# Altium schematic sheet 系统接线图.SchDoc
size A3
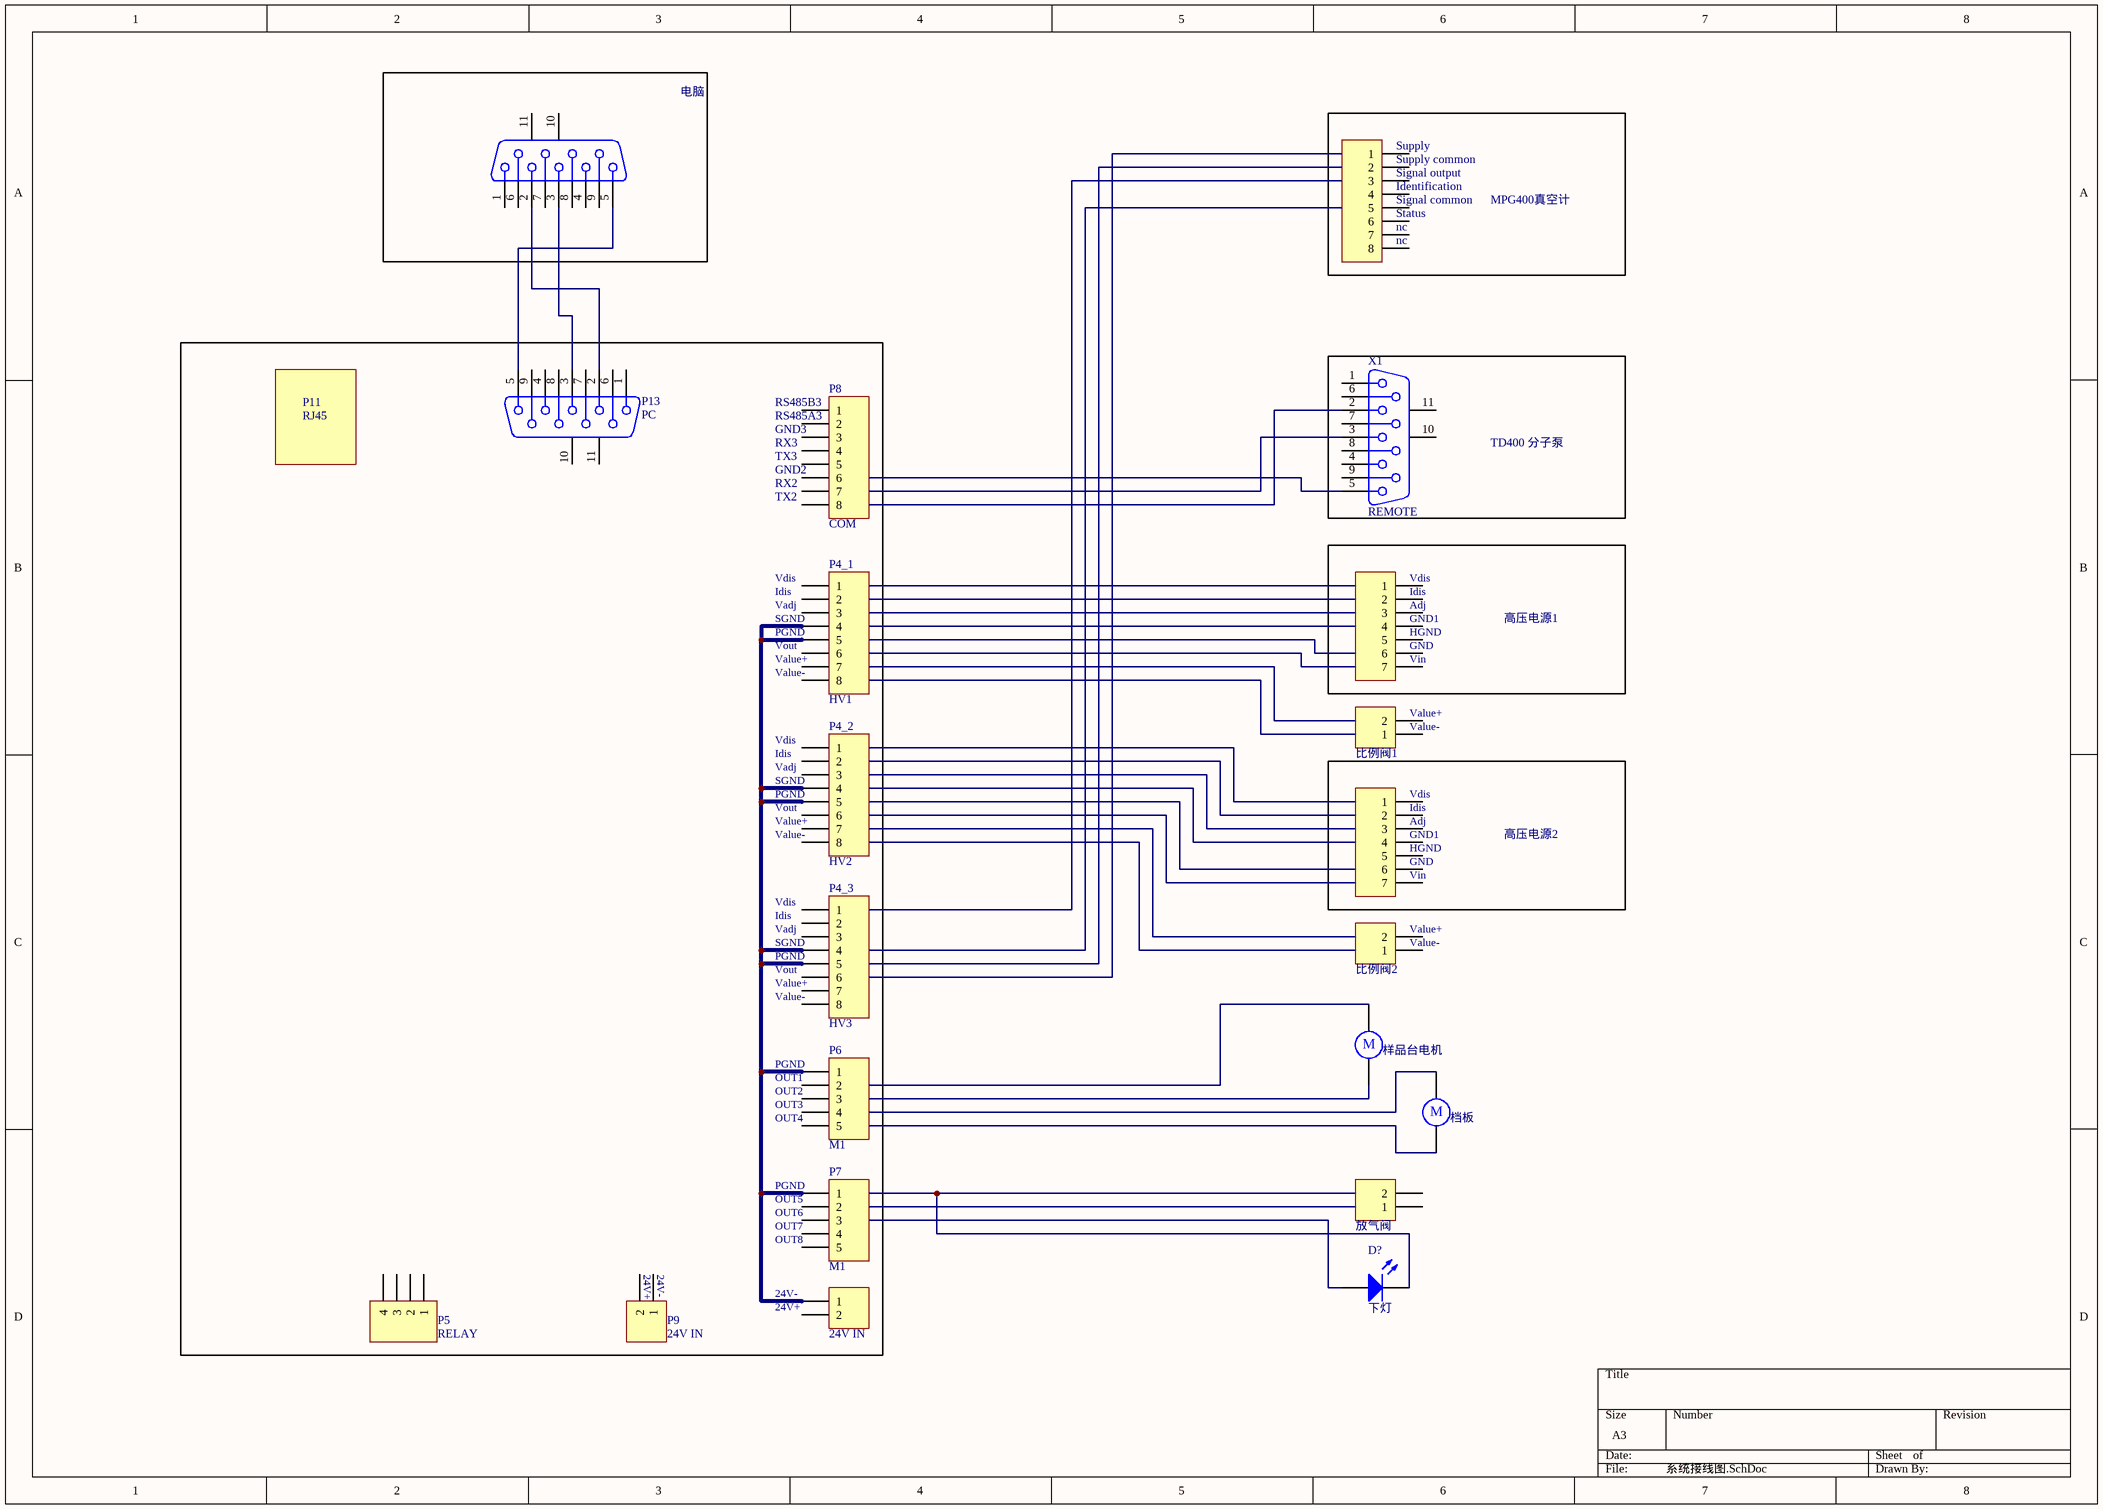
[diagram p0: 系统接线图.SchDoc]

## Parts
(Parts that share a designator on the sheet are numbered #1, #2 ... from top to bottom, then left to right.)
B?#1  样品台电机  [RB5-10.5]
B?#2  档板  [RB5-10.5]
D?  下灯  [LED-0]
P1  24V IN  [MHDR1X2]
P4_1  HV1  [MHDR1X8]
P4_2  HV2  [MHDR1X8]
P4_3  HV3  [MHDR1X8]
P5  RELAY  [MHDR1X4]
P6  M1  [MHDR1X5]
P7  M1  [MHDR1X5]
P8  COM  [MHDR1X8]
P9  24V IN  [MHDR1X2]
P13  PC  [DSUB1.385-2H9]
P?#1  PC  [DSUB1.385-2H9]  (value not drawn)
P?#2  MPG400真空计  [MHDR1X8]
P?#3  高压电源1  [MHDR1X7]
P?#4  比例阀1  [MHDR1X2]
P?#5  高压电源2  [MHDR1X7]
P?#6  比例阀2  [MHDR1X2]
P?#7  放气阀  [MHDR1X2]
X1  REMOTE  [DSUB1.385-2H9]

## Blocks framed on the sheet
电脑: P?#1
TD400 分子泵: X1

## Nets
NetP1_1: P1.1 P4_1.4 P4_1.5 P4_2.4 P4_2.5 P4_3.4 P4_3.5 P6.1 P7.1
NetP13_2: P13.2 P?#1.2
NetP13_3: P13.3 P?#1.3
NetP13_5: P13.5 P?#1.5

Not connected (* = marked no-connect by the designer): B?#1 1 2; B?#2 1 2; D? 1(A) 2(K); P1 2; P4_1 1 2 3 6 7 8; P4_2 1 2 3 6 7 8; P4_3 1 2 3 6 7 8; P5 1 2 3 4; P6 2 3 4 5; P7 2 3 4 5; P8 1 2 3 4 5 6 7 8; P9 1 2; P13 1 4 6 7 8 9 10(MH1) 11(MH2); P?#1 1 4 6 7 8 9 10(MH1) 11(MH2); P?#2 1 2 3 4 5 6 7 8; P?#3 1 2 3 4 5 6 7; P?#4 1 2; P?#5 1 2 3 4 5 6 7; P?#6 1 2; P?#7 1 2; X1 1 2 3 4 5 6 7 8 9 10(MH1) 11(MH2)

## Notes on the sheet
- (near P?#2) Supply
- (near P?#2) Supply common
- (near P?#2) Signal output
- (near P?#2) Identification
- (near P?#2) Signal common
- (near P?#2) Status
- (near P?#2) nc
- RJ45
- P11
- (near P8) RX3
- (near P8) GND3
- (near P8) RS485A3
- (near P8) RS485B3
- (near P8) TX2
- (near P8) RX2
- (near P8) GND2
- (near P8) TX3
- (near P4_1) Vdis
- (near P?#3) Vdis
- (near P4_1) Idis
- (near P4_1) Vadj
- (near P4_1) SGND
- (near P4_1) PGND
- (near P4_1) Vout
- (near P?#3) Idis
- (near P?#3) Adj
- (near P?#3) GND1
- (near P?#3) GND
- (near P?#3) HGND
- (near P4_1) Value+
- (near P4_1) Value-
- (near P?#3) Vin
- (near P?#4) Value+
- (near P4_2) Vdis
- (near P4_2) Idis
- (near P4_2) Vadj
- (near P4_2) SGND
- (near P?#4) Value-
- (near P4_2) PGND
- (near P4_2) Vout
- (near P4_2) Value+
- (near P4_2) Value-
- (near P?#5) Vdis
- (near P?#5) Idis
- (near P?#5) Adj
- (near P?#5) GND1
- (near P?#5) HGND
- (near P4_3) Vdis
- (near P4_3) Idis
- (near P?#5) GND
- (near P?#5) Vin
- (near P4_3) Vadj
- (near P4_3) SGND
- (near P4_3) PGND
- (near P4_3) Vout
- (near P4_3) Value+
- (near P?#6) Value+
- (near P?#6) Value-
- (near P4_3) Value-
- (near P6) PGND
- (near P6) OUT1
- (near P6) OUT2
- (near P6) OUT3
- (near P6) OUT4
- (near P7) PGND
- (near P7) OUT5
- (near P7) OUT6
- (near P7) OUT7
- (near P7) OUT8
- (near P9) 24V+
- (near P9) 24V-
- (near P1) 24V-
- (near P1) 24V+
- (in symbol Motor) M

## Library data of the parts
B?#1 B?#2 = Motor: Motor, General Kind; Published: 24-Mar-1999; LatestRevisionDate: 17-Jul-2002; LatestRevisionNote: Re-released for DXP Platform.; PackageReference: RB5-10.5; Publisher: Altium Limited; PackageDescription: Capacitor (Radial); 2 Leads
D? = LED0: Typical INFRARED GaAs LED; Published: 8-Jun-2000; LatestRevisionDate: 08-Jul-2005; LatestRevisionNote: Mech Layer 1 removed.; PackageReference: LED-0; Publisher: Altium Limited; PackageDescription: LED; 2 Leads
P1 P9 P?#4 P?#6 P?#7 = MHDR1X2: Header, 2-Pin; LatestRevisionDate: 17-Jul-2002; LatestRevisionNote: Re-released for DXP Platform.; Publisher: Altium Limited
P4_1-P4_3 P8 P?#2 = MHDR1X8: Header, 8-Pin; LatestRevisionDate: 17-Jul-2002; LatestRevisionNote: Re-released for DXP Platform.; Publisher: Altium Limited
P5 = MHDR1X4: Header, 4-Pin; LatestRevisionDate: 17-Jul-2002; LatestRevisionNote: Re-released for DXP Platform.; Publisher: Altium Limited
P6 P7 = MHDR1X5: Header, 5-Pin; LatestRevisionDate: 17-Jul-2002; LatestRevisionNote: Re-released for DXP Platform.; Publisher: Altium Limited
P13 P?#1 X1 = D Connector 9: Receptacle Assembly, 9 Position, Right Angle; PackageDocument: O; Positions: 9; Published: 15-Jun-2001; LatestRevisionDate: 17-Jul-2002; LatestRevisionNote: Re-released for DXP Platform.; DatasheetDocument: 1-Sep-1999; PackageReference: 788750; Publisher: Altium Limited; Orientation: Right Angle; Gender: Receptacle
P?#3 P?#5 = MHDR1X7: Header, 7-Pin; LatestRevisionDate: 17-Jul-2002; LatestRevisionNote: Re-released for DXP Platform.; Publisher: Altium Limited